# Altium schematic sheet RightBar2_SchDoc.SchDoc
size A4
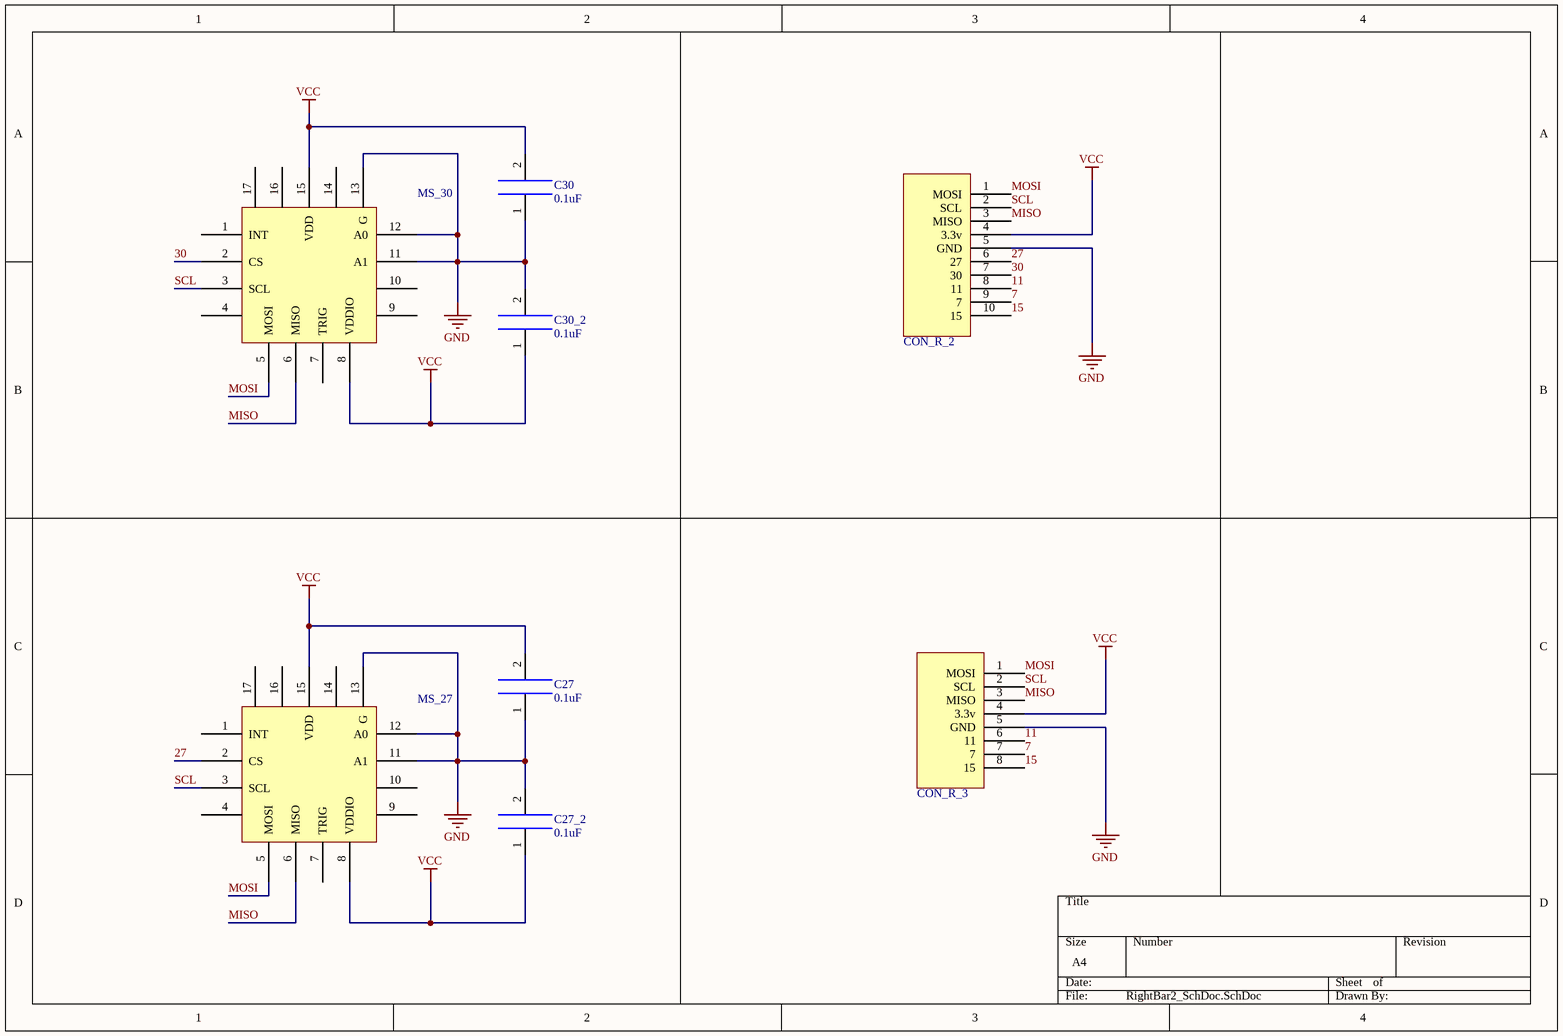
[diagram p0: RightBar2_SchDoc.SchDoc]

## Parts
C27  0.1uF  [CAP_0603]
C27_2  0.1uF  [CAP_0603]
C30  0.1uF  [CAP_0603]
C30_2  0.1uF  [CAP_0603]
CON_R_2  PIN_right  [PIN_RIGHT_2]  (value not drawn)
CON_R_3  PIN_right  [PIN_RIGHT_3]  (value not drawn)
MS_27  MLX90393SLW ABA 011 RE  [MLX90393]  (value not drawn)
MS_30  MLX90393SLW ABA 011 RE  [MLX90393]  (value not drawn)

## Nets
GND: C27.1 C27_2.2 C30.1 C30_2.2 CON_R_2.5(GND) CON_R_3.5(GND) MS_27.11(A1) MS_27.12(A0) MS_27.13(G) MS_30.11(A1) MS_30.12(A0) MS_30.13(G)
VCC: C27.2 C27_2.1 C30.2 C30_2.1 CON_R_2.4(3.3v) CON_R_3.4(3.3v) MS_27.8(VDDIO) MS_27.15(VDD) MS_30.8(VDDIO) MS_30.15(VDD)
7: CON_R_2.9(7) CON_R_3.7
11: CON_R_2.8(11) CON_R_3.6(11)
15: CON_R_2.10(15) CON_R_3.8(15)
27: CON_R_2.6(27) MS_27.2(CS)
30: CON_R_2.7(30) MS_30.2(CS)
MISO: CON_R_2.3(MISO) CON_R_3.3(MISO) MS_27.6(MISO) MS_30.6(MISO)
MOSI: CON_R_2.1(MOSI) CON_R_3.1(MOSI) MS_27.5(MOSI) MS_30.5(MOSI)
SCL: CON_R_2.2(SCL) CON_R_3.2(SCL) MS_27.3(SCL) MS_30.3(SCL)

Not connected (* = marked no-connect by the designer): MS_27 1(INT) 4 7(TRIG) 9 10 14 16 17; MS_30 1(INT) 4 7(TRIG) 9 10 14 16 17

## Library data of the parts
C27 C27_2 C30 C30_2 = CAP: Capacitance
CON_R_2 = PIN_right_2
CON_R_3 = PIN_right_3
MS_27 MS_30 = MLX90393SLW ABA 011 RE: MLX90393 Sensor